# Altium schematic sheet 3_VW_Sensor.SchDoc
size A4
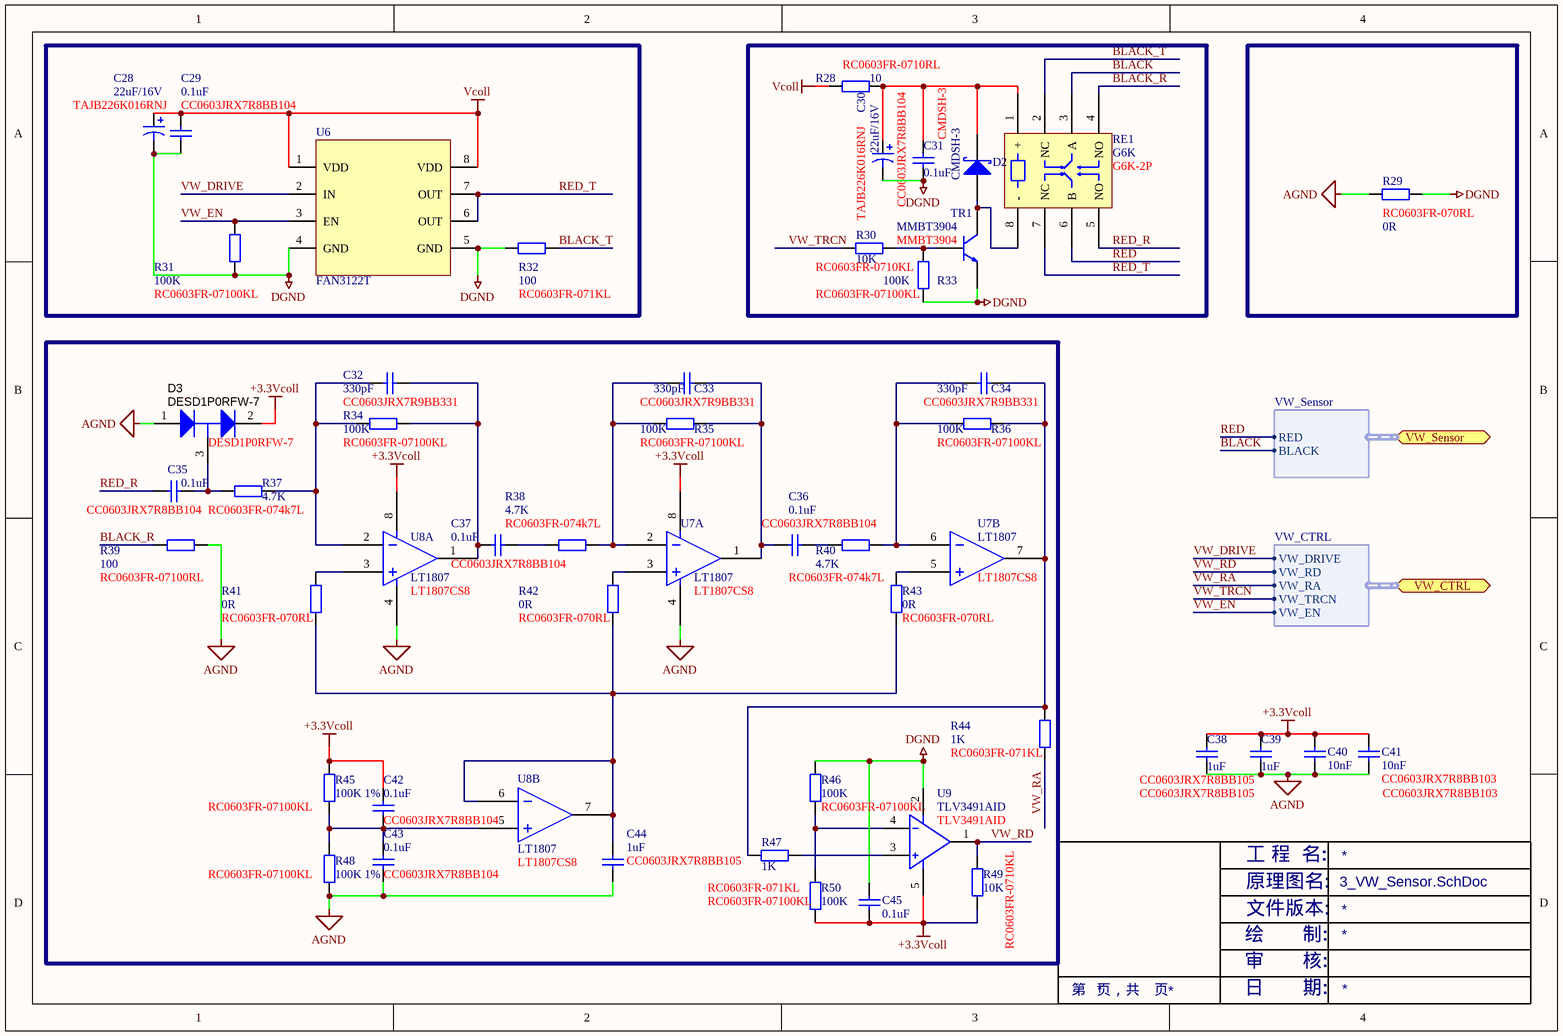
[diagram p0: 3_VW_Sensor.SchDoc]

## Parts
C28  22uF/16V  Part No.: TAJB226K016RNJ  [CB3528]
C29  0.1uF  Type No.: CC0603JRX7R8BB104  [CC0603]
C30  22uF/16V  Part No.: TAJB226K016RNJ  [CB3528]
C31  0.1uF  Type No.: CC0603JRX7R8BB104  [CC0603]
C32  330pF  Type No.: CC0603JRX7R9BB331  [CC0603]
C33  330pF  Type No.: CC0603JRX7R9BB331  [CC0603]
C34  330pF  Type No.: CC0603JRX7R9BB331  [CC0603]
C35  0.1uF  Type No.: CC0603JRX7R8BB104  [CC0603]
C36  0.1uF  Type No.: CC0603JRX7R8BB104  [CC0603]
C37  0.1uF  Type No.: CC0603JRX7R8BB104  [CC0603]
C38  1uF  Type No.: CC0603JRX7R8BB105  [CC0603]
C39  1uF  Type No.: CC0603JRX7R8BB105  [CC0603]
C40  10nF  Type No.: CC0603JRX7R8BB103  [CC0603]
C41  10nF  Type No.: CC0603JRX7R8BB103  [CC0603]
C42  0.1uF  Type No.: CC0603JRX7R8BB104  [CC0603]
C43  0.1uF  Type No.: CC0603JRX7R8BB104  [CC0603]
C44  1uF  Type No.: CC0603JRX7R8BB105  [CC0603]
C45  0.1uF  [CC0603]
D2  CMDSH-3  [SOD323]
D3  DESD1P0RFW-7  [SOT-323]
R28  10  Type No.: RC0603FR-0710RL  [CC0603]
R29  0R  Type No.: RC0603FR-070RL  [CC0603]
R30  10K  Type No.: RC0603FR-0710KL  [CC0603]
R31  100K  Type No.: RC0603FR-07100KL  [CC0603]
R32  100  Type No.: RC0603FR-071KL  [CC0603]
R33  100K  Type No.: RC0603FR-07100KL  [CC0603]
R34  100K  Type No.: RC0603FR-07100KL  [CC0603]
R35  100K  Type No.: RC0603FR-07100KL  [CC0603]
R36  100K  Type No.: RC0603FR-07100KL  [CC0603]
R37  4.7K  Type No.: RC0603FR-074k7L  [CC0603]
R38  4.7K  Type No.: RC0603FR-074k7L  [CC0603]
R39  100  Type No.: RC0603FR-07100RL  [CC0603]
R40  4.7K  Type No.: RC0603FR-074k7L  [CC0603]
R41  0R  Type No.: RC0603FR-070RL  [CC0603]
R42  0R  Type No.: RC0603FR-070RL  [CC0603]
R43  0R  Type No.: RC0603FR-070RL  [CC0603]
R44  1K  Type No.: RC0603FR-071KL  [CC0603]
R45  100K 1%  Type No.: RC0603FR-07100KL  [CC0603]
R46  100K  Type No.: RC0603FR-07100KL  [CC0603]
R47  1K  Type No.: RC0603FR-071KL  [CC0603]
R48  100K 1%  Type No.: RC0603FR-07100KL  [CC0603]
R49  10K  Type No.: RC0603FR-0710KL  [CC0603]
R50  100K  Type No.: RC0603FR-07100KL  [CC0603]
RE1  G6K  Type No.: G6K-2P  [G6K]
TR1  MMBT3904  [SOT-23W]
U6  FAN3122T  [SO-8]
U7  LT1807  Type No.: LT1807CS8  [SO-8]  (parts A,B of 2)
U8  LT1807  Type No.: LT1807CS8  [SO-8]  (parts A,B of 2)
U9  TLV3491AID  [SOT-23-5]

## Ports
VW_CTRL (harness VW_CTRL), VW_Sensor (harness VW_Sensor)

## Harnesses
VW_CTRL: VW_RA, VW_DRIVE, VW_TRCN, VW_EN, VW_RD
VW_Sensor: RED, BLACK

## Nets
+3.3Vcoll: C38.2 C39.2 C40.1 C41.1 C42.1 C45.2 D3.2(K) R45.1 R49.1 R50.1 U7.8 U8.8 U9.5(+VS)
AGND: C38.1 C39.1 C40.2 C41.2 C43.2 C44.1 D3.1(A) R29.1 R39.2 R48.2 U7.4 U8.4
DGND: C28.2 C29.1 C30.2 C31.2 C45.1 R29.2 R31.2 R32.2 R33.1 R46.2 TR1.2 U6.4(GND) U6.5(GND) U9.2(-VS)
Vcoll: C28.1 C29.2 R28.1 U6.1(VDD) U6.8(VDD)
BLACK: RE1.3(A) ; port VW_Sensor.BLACK
BLACK_R: R39.1 RE1.4(NO)
BLACK_T: R32.1 RE1.2(NC)
RED: RE1.6(B) ; port VW_Sensor.RED
RED_R: C35.2 RE1.5(NO)
RED_T: RE1.7(NC) U6.6(OUT) U6.7(OUT)
VW_DRIVE: U6.2(IN) ; port VW_CTRL.VW_DRIVE
VW_EN: R31.1 U6.3(EN) ; port VW_CTRL.VW_EN
VW_RA: R44.2 ; port VW_CTRL.VW_RA
VW_RD: R49.2 U9.1(OUT) ; port VW_CTRL.VW_RD
VW_TRCN: R30.1 ; port VW_CTRL.VW_TRCN
NetC30_1: C30.1 C31.1 D2.2(K) R28.2 RE1.1(+)
NetC32_1: C32.1 C37.2 R34.1 U8.1
NetC32_2: C32.2 R34.2 R37.1 U8.2
NetC33_1: C33.1 C36.2 R35.1 U7.1
NetC33_2: C33.2 R35.2 R38.1 U7.2
NetC34_1: C34.1 R36.1 R44.1 R47.2 U7.7
NetC34_2: C34.2 R36.2 R40.1 U7.6
NetC35_1: C35.1 D3.3(C) R37.2
NetC36_1: C36.1 R40.2
NetC37_1: C37.1 R38.2
NetC42_2: C42.2 C43.1 R45.2 R48.1 U8.5
NetC44_2: C44.2 R41.2 R42.2 R43.2 U8.6 U8.7
NetD2_1: D2.1(A) RE1.8(-) TR1.3
NetR30_2: R30.2 R33.2 TR1.1
NetR41_1: R41.1 U8.3
NetR42_1: R42.1 U7.3
NetR43_1: R43.1 U7.5
NetR46_1: R46.1 R50.2 U9.4(-)
NetR47_1: R47.1 U9.3(+)

## Notes on the sheet
- 文件版本:
- 原理图名:
- 工 程  名:
- 绘       制:
- 审       核:
- 第   页，共    页
- 日       期:

## Library data of the parts
C28 C30 = Cap Pol1: Polarized Capacitor (Radial)
C29 C31-C45 = Cap: Capacitor
  C45: Published: 8-Jun-2000; LatestRevisionDate: 17-Jul-2002; LatestRevisionNote: Re-released for DXP Platform.; PackageReference: RAD-0.3; Publisher: Altium Limited; Value: 0.1uF
D2 = D Schottky: Schottky Diode; Type No.: CMDSH-3
D3 = BAV99WT1G: TVS DIODE,70VVVM,8VC,SOT-323; Type No.: DESD1P0RFW-7
R28-R50 = Res2: Resistor
TR1 = NPN: Type No.: MMBT3904
U6 = FAN3122
U7 U8 = LM833N
U9 = TLV3491AID: Type No.: TLV3491AID